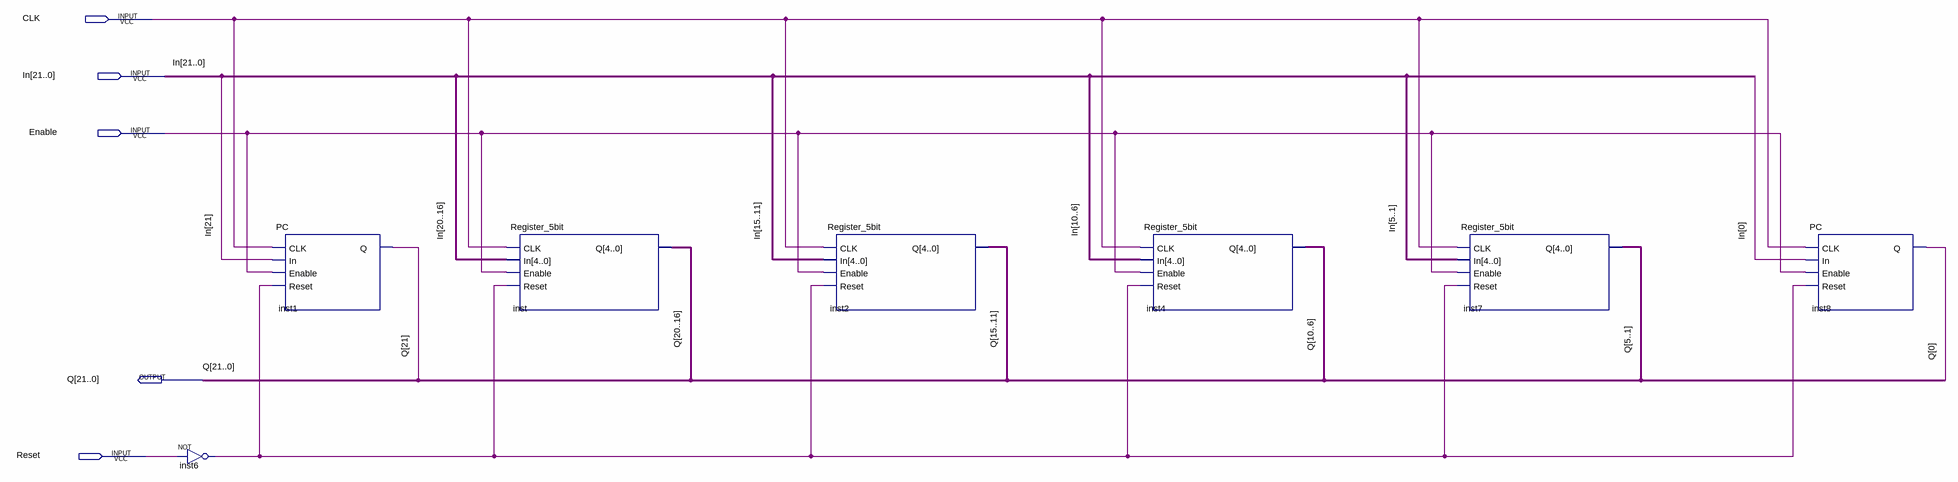
[diagram p0: schematic sheet]
// Quartus schematic Register_22bit.bdf as structural Verilog: 7 symbols, 5 pins
module Register_22bit (
  input  CLK,
  input  [21:0] In,
  input  Enable,
  input  Reset,
  output [21:0] Q
);

  wire inst6_out;

  not inst6 (inst6_out, Reset);
  PC inst1 (.CLK(CLK), .In(In[21]), .Enable(Enable), .Reset(inst6_out), .Q(Q[21]));
  Register_5bit inst (.CLK(CLK), .In(In[20:16]), .Enable(Enable), .Reset(inst6_out), .Q(Q[20:16]));
  Register_5bit inst2 (.CLK(CLK), .In(In[15:11]), .Enable(Enable), .Reset(inst6_out), .Q(Q[15:11]));
  Register_5bit inst4 (.CLK(CLK), .In(In[10:6]), .Enable(Enable), .Reset(inst6_out), .Q(Q[10:6]));
  Register_5bit inst7 (.CLK(CLK), .In(In[5:1]), .Enable(Enable), .Reset(inst6_out), .Q(Q[5:1]));
  PC inst8 (.CLK(CLK), .In(In[0]), .Enable(Enable), .Reset(inst6_out), .Q(Q[0]));
endmodule
